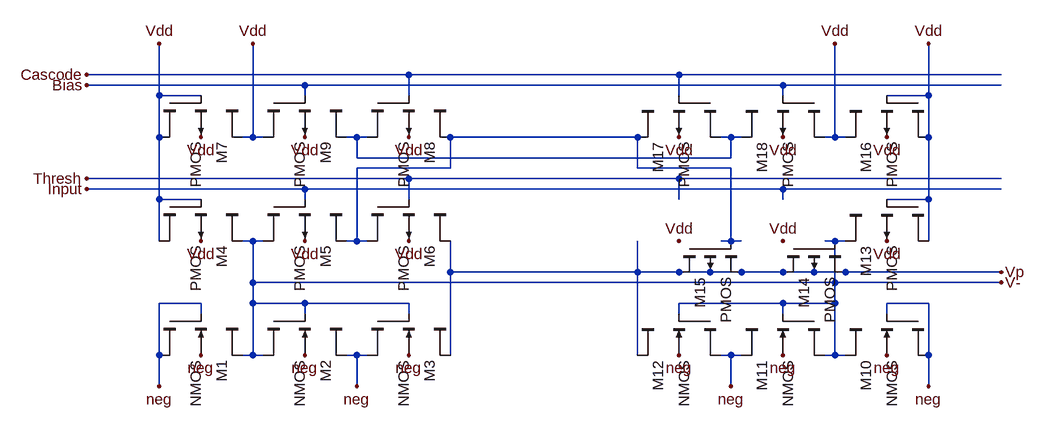
[diagram p0: schematic doubleComparatorPreampLVS.asc]
doubleComparatorPreampLVS.asc, the LTspice schematic file:
Version 4
SHEET 1 1456 680
WIRE 416 -192 -80 -192
WIRE 832 -192 416 -192
WIRE 1328 -192 832 -192
WIRE 256 -176 -80 -176
WIRE 992 -176 256 -176
WIRE 1328 -176 992 -176
WIRE 32 -160 32 -240
WIRE 96 -160 32 -160
WIRE 256 -160 256 -176
WIRE 416 -160 416 -192
WIRE 832 -160 832 -192
WIRE 992 -160 992 -176
WIRE 1216 -160 1216 -240
WIRE 1216 -160 1152 -160
WIRE 32 -96 32 -160
WIRE 176 -96 176 -240
WIRE 176 -96 160 -96
WIRE 192 -96 176 -96
WIRE 336 -96 320 -96
WIRE 352 -96 336 -96
WIRE 768 -96 480 -96
WIRE 912 -96 896 -96
WIRE 928 -96 912 -96
WIRE 1072 -96 1072 -240
WIRE 1072 -96 1056 -96
WIRE 1088 -96 1072 -96
WIRE 1216 -96 1216 -160
WIRE 336 -64 336 -96
WIRE 912 -64 912 -96
WIRE 912 -64 336 -64
WIRE 480 -48 480 -96
WIRE 480 -48 336 -48
WIRE 768 -48 768 -96
WIRE 912 -48 768 -48
WIRE 416 -32 -80 -32
WIRE 832 -32 416 -32
WIRE 1328 -32 832 -32
WIRE 256 -16 -80 -16
WIRE 992 -16 256 -16
WIRE 1328 -16 992 -16
WIRE 32 0 32 -96
WIRE 96 0 32 0
WIRE 256 0 256 -16
WIRE 416 0 416 -32
WIRE 832 0 832 -32
WIRE 992 0 992 -16
WIRE 1216 0 1216 -96
WIRE 1216 0 1152 0
WIRE 32 64 32 0
WIRE 176 64 160 64
WIRE 192 64 176 64
WIRE 336 64 336 -48
WIRE 336 64 320 64
WIRE 352 64 336 64
WIRE 912 64 912 -48
WIRE 912 64 896 64
WIRE 928 64 912 64
WIRE 1072 64 1056 64
WIRE 1088 64 1072 64
WIRE 1216 64 1216 0
WIRE 480 112 480 64
WIRE 768 112 768 64
WIRE 768 112 480 112
WIRE 1328 112 768 112
WIRE 176 128 176 64
WIRE 1072 128 1072 64
WIRE 1072 128 176 128
WIRE 1328 128 1072 128
WIRE 96 160 32 160
WIRE 176 160 176 128
WIRE 256 160 176 160
WIRE 416 160 256 160
WIRE 992 160 832 160
WIRE 1072 160 1072 128
WIRE 1072 160 992 160
WIRE 1216 160 1152 160
WIRE 96 176 96 160
WIRE 256 176 256 160
WIRE 416 176 416 160
WIRE 832 176 832 160
WIRE 992 176 992 160
WIRE 1152 176 1152 160
WIRE 32 240 32 160
WIRE 176 240 176 160
WIRE 176 240 160 240
WIRE 192 240 176 240
WIRE 336 240 320 240
WIRE 352 240 336 240
WIRE 480 240 480 112
WIRE 768 240 768 112
WIRE 912 240 896 240
WIRE 928 240 912 240
WIRE 1072 240 1072 160
WIRE 1072 240 1056 240
WIRE 1088 240 1072 240
WIRE 1216 240 1216 160
WIRE 32 288 32 240
WIRE 336 288 336 240
WIRE 912 288 912 240
WIRE 1216 288 1216 240
FLAG 96 64 Vdd
FLAG 256 64 Vdd
FLAG 416 64 Vdd
FLAG 96 -96 Vdd
FLAG 416 -96 Vdd
FLAG 256 -96 Vdd
FLAG 32 -240 Vdd
FLAG 176 -240 Vdd
FLAG -80 -16 Input
FLAG -80 -32 Thresh
FLAG -80 -192 Cascode
FLAG -80 -176 Bias
FLAG 1152 64 Vdd
FLAG 992 64 Vdd
FLAG 832 64 Vdd
FLAG 1152 -96 Vdd
FLAG 832 -96 Vdd
FLAG 992 -96 Vdd
FLAG 1216 -240 Vdd
FLAG 1072 -240 Vdd
FLAG 1328 112 Vp
FLAG 1216 288 neg
FLAG 1152 240 neg
FLAG 992 240 neg
FLAG 912 288 neg
FLAG 416 240 neg
FLAG 336 288 neg
FLAG 256 240 neg
FLAG 96 240 neg
FLAG 32 288 neg
FLAG 832 240 neg
FLAG 1328 128 V-
SYMBOL cktsym\\nmos4 96 240 R90
SYMATTR InstName M1
SYMATTR Value2 l=.9u w=1.5u
SYMBOL cktsym\\nmos4 256 240 R90
SYMATTR InstName M2
SYMATTR Value2 l=.9u w=1.5u
SYMBOL cktsym\\nmos4 416 240 R90
SYMATTR InstName M3
SYMATTR Value2 l=.9u w=1.5u
SYMBOL cktsym\\pmos4 96 64 R90
SYMATTR InstName M4
SYMATTR Value2 l=.9u w=1.5u
SYMBOL cktsym\\pmos4 256 64 R90
SYMATTR InstName M5
SYMATTR Value2 l=.9u w=1.5u
SYMBOL cktsym\\pmos4 416 64 R90
SYMATTR InstName M6
SYMATTR Value2 l=.9u w=1.5u
SYMBOL cktsym\\pmos4 96 -96 R90
SYMATTR InstName M7
SYMATTR Value2 l=.9u w=1.8u
SYMBOL cktsym\\pmos4 416 -96 R90
SYMATTR InstName M8
SYMATTR Value2 l=.9u w=1.8u
SYMBOL cktsym\\pmos4 256 -96 R90
SYMATTR InstName M9
SYMATTR Value2 l=3.9u w=8.1u
SYMBOL cktsym\\nmos4 1152 240 M90
SYMATTR InstName M10
SYMATTR Value2 l=.9u w=1.5u
SYMBOL cktsym\\nmos4 992 240 M90
SYMATTR InstName M11
SYMATTR Value2 l=.9u w=1.5u
SYMBOL cktsym\\nmos4 832 240 M90
SYMATTR InstName M12
SYMATTR Value2 l=.9u w=1.5u
SYMBOL cktsym\\pmos4 1152 64 M90
SYMATTR InstName M13
SYMATTR Value2 l=.9u w=1.5u
SYMBOL cktsym\\pmos4 992 64 M90
SYMATTR InstName M14
SYMATTR Value2 l=.9u w=1.5u
SYMBOL cktsym\\pmos4 832 64 M90
SYMATTR InstName M15
SYMATTR Value2 l=.9u w=1.5u
SYMBOL cktsym\\pmos4 1152 -96 M90
SYMATTR InstName M16
SYMATTR Value2 l=.9u w=1.8u
SYMBOL cktsym\\pmos4 832 -96 M90
SYMATTR InstName M17
SYMATTR Value2 l=.9u w=1.8u
SYMBOL cktsym\\pmos4 992 -96 M90
SYMATTR InstName M18
SYMATTR Value2 l=3.9u w=8.1u

The netlist it stands for:
* doubleComparatorPreampLVS.asc
M1 V- neg neg neg NMOS l=.9u w=1.5u
M2 neg V- V- neg NMOS l=.9u w=1.5u
M3 Vp V- neg neg NMOS l=.9u w=1.5u
M4 Vdd Vdd V- Vdd PMOS l=.9u w=1.5u
M5 V- Input N002 Vdd PMOS l=.9u w=1.5u
M6 N002 Thresh Vp Vdd PMOS l=.9u w=1.5u
M7 Vdd Vdd Vdd Vdd PMOS l=.9u w=1.8u
M8 N001 Cascode N002 Vdd PMOS l=.9u w=1.8u
M9 Vdd Bias N001 Vdd PMOS l=3.9u w=8.1u
M10 V- neg neg neg NMOS l=.9u w=1.5u
M11 neg V- V- neg NMOS l=.9u w=1.5u
M12 Vp V- neg neg NMOS l=.9u w=1.5u
M13 Vdd Vdd V- Vdd PMOS l=.9u w=1.5u
M14 Vp V- Vp Vp PMOS l=.9u w=1.5u
M15 Vp N002 Vp Vp PMOS l=.9u w=1.5u
M16 Vdd Vdd Vdd Vdd PMOS l=.9u w=1.8u
M17 N001 Cascode N002 Vdd PMOS l=.9u w=1.8u
M18 Vdd Bias N001 Vdd PMOS l=3.9u w=8.1u
.model NMOS NMOS
.model PMOS PMOS
.lib standard.mos
.backanno
.end